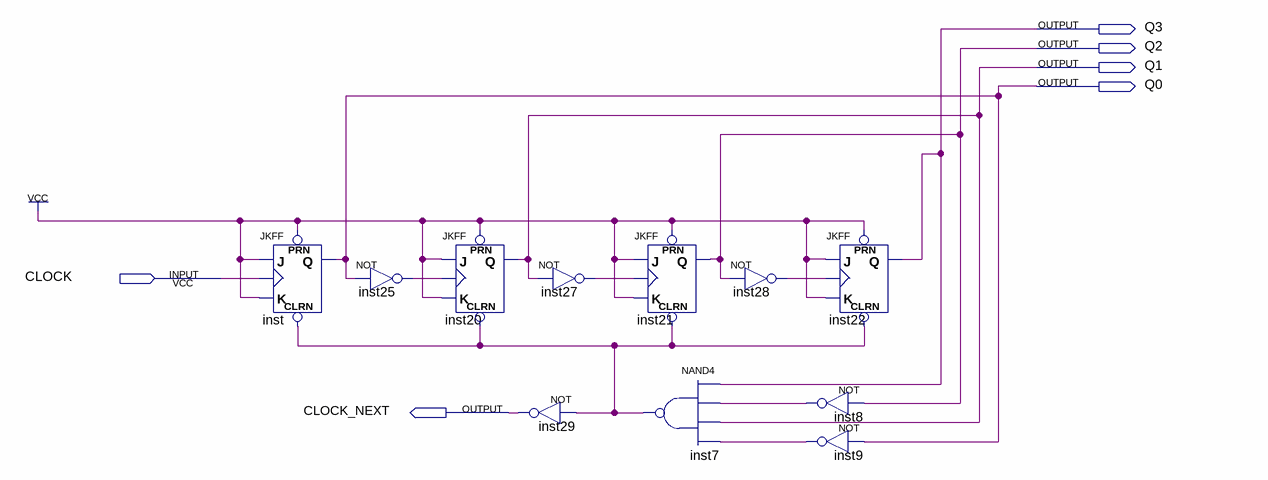
[diagram p0: schematic sheet]
// Quartus schematic decade_counter_up.bdf as structural Verilog: 11 symbols, 6 pins
module decade_counter_up (
  input  CLOCK,
  output Q3,
  output Q2,
  output Q1,
  output Q0,
  output CLOCK_NEXT
);

  wire inst7_out, inst8_out, inst9_out, inst25_out, inst27_out, inst28_out;

  JKFF inst (.PRN(1'b1), .CLRN(inst7_out), .K(1'b1), .J(1'b1), .CLK(CLOCK), .Q(Q0));
  not inst25 (inst25_out, Q0);
  JKFF inst20 (.PRN(1'b1), .CLRN(inst7_out), .K(1'b1), .J(1'b1), .CLK(inst25_out), .Q(Q1));
  not inst29 (CLOCK_NEXT, inst7_out);
  not inst27 (inst27_out, Q1);
  JKFF inst21 (.PRN(1'b1), .CLRN(inst7_out), .K(1'b1), .J(1'b1), .CLK(inst27_out), .Q(Q2));
  nand inst7 (inst7_out, Q3, inst8_out, Q1, inst9_out);
  not inst28 (inst28_out, Q2);
  JKFF inst22 (.PRN(1'b1), .CLRN(inst7_out), .K(1'b1), .J(1'b1), .CLK(inst28_out), .Q(Q3));
  not inst8 (inst8_out, Q2);
  not inst9 (inst9_out, Q0);
endmodule
